# EasyEDA Pro project ProDoc_Board1_Smaller_2026-06-28.epro

# Schematic Schematic1_1
Create Date: 2024-08-01; Page Name: P1; Project Name: LED board Gelsight; Schematic Name: Schematic1_1; Update Date: 2024-08-03
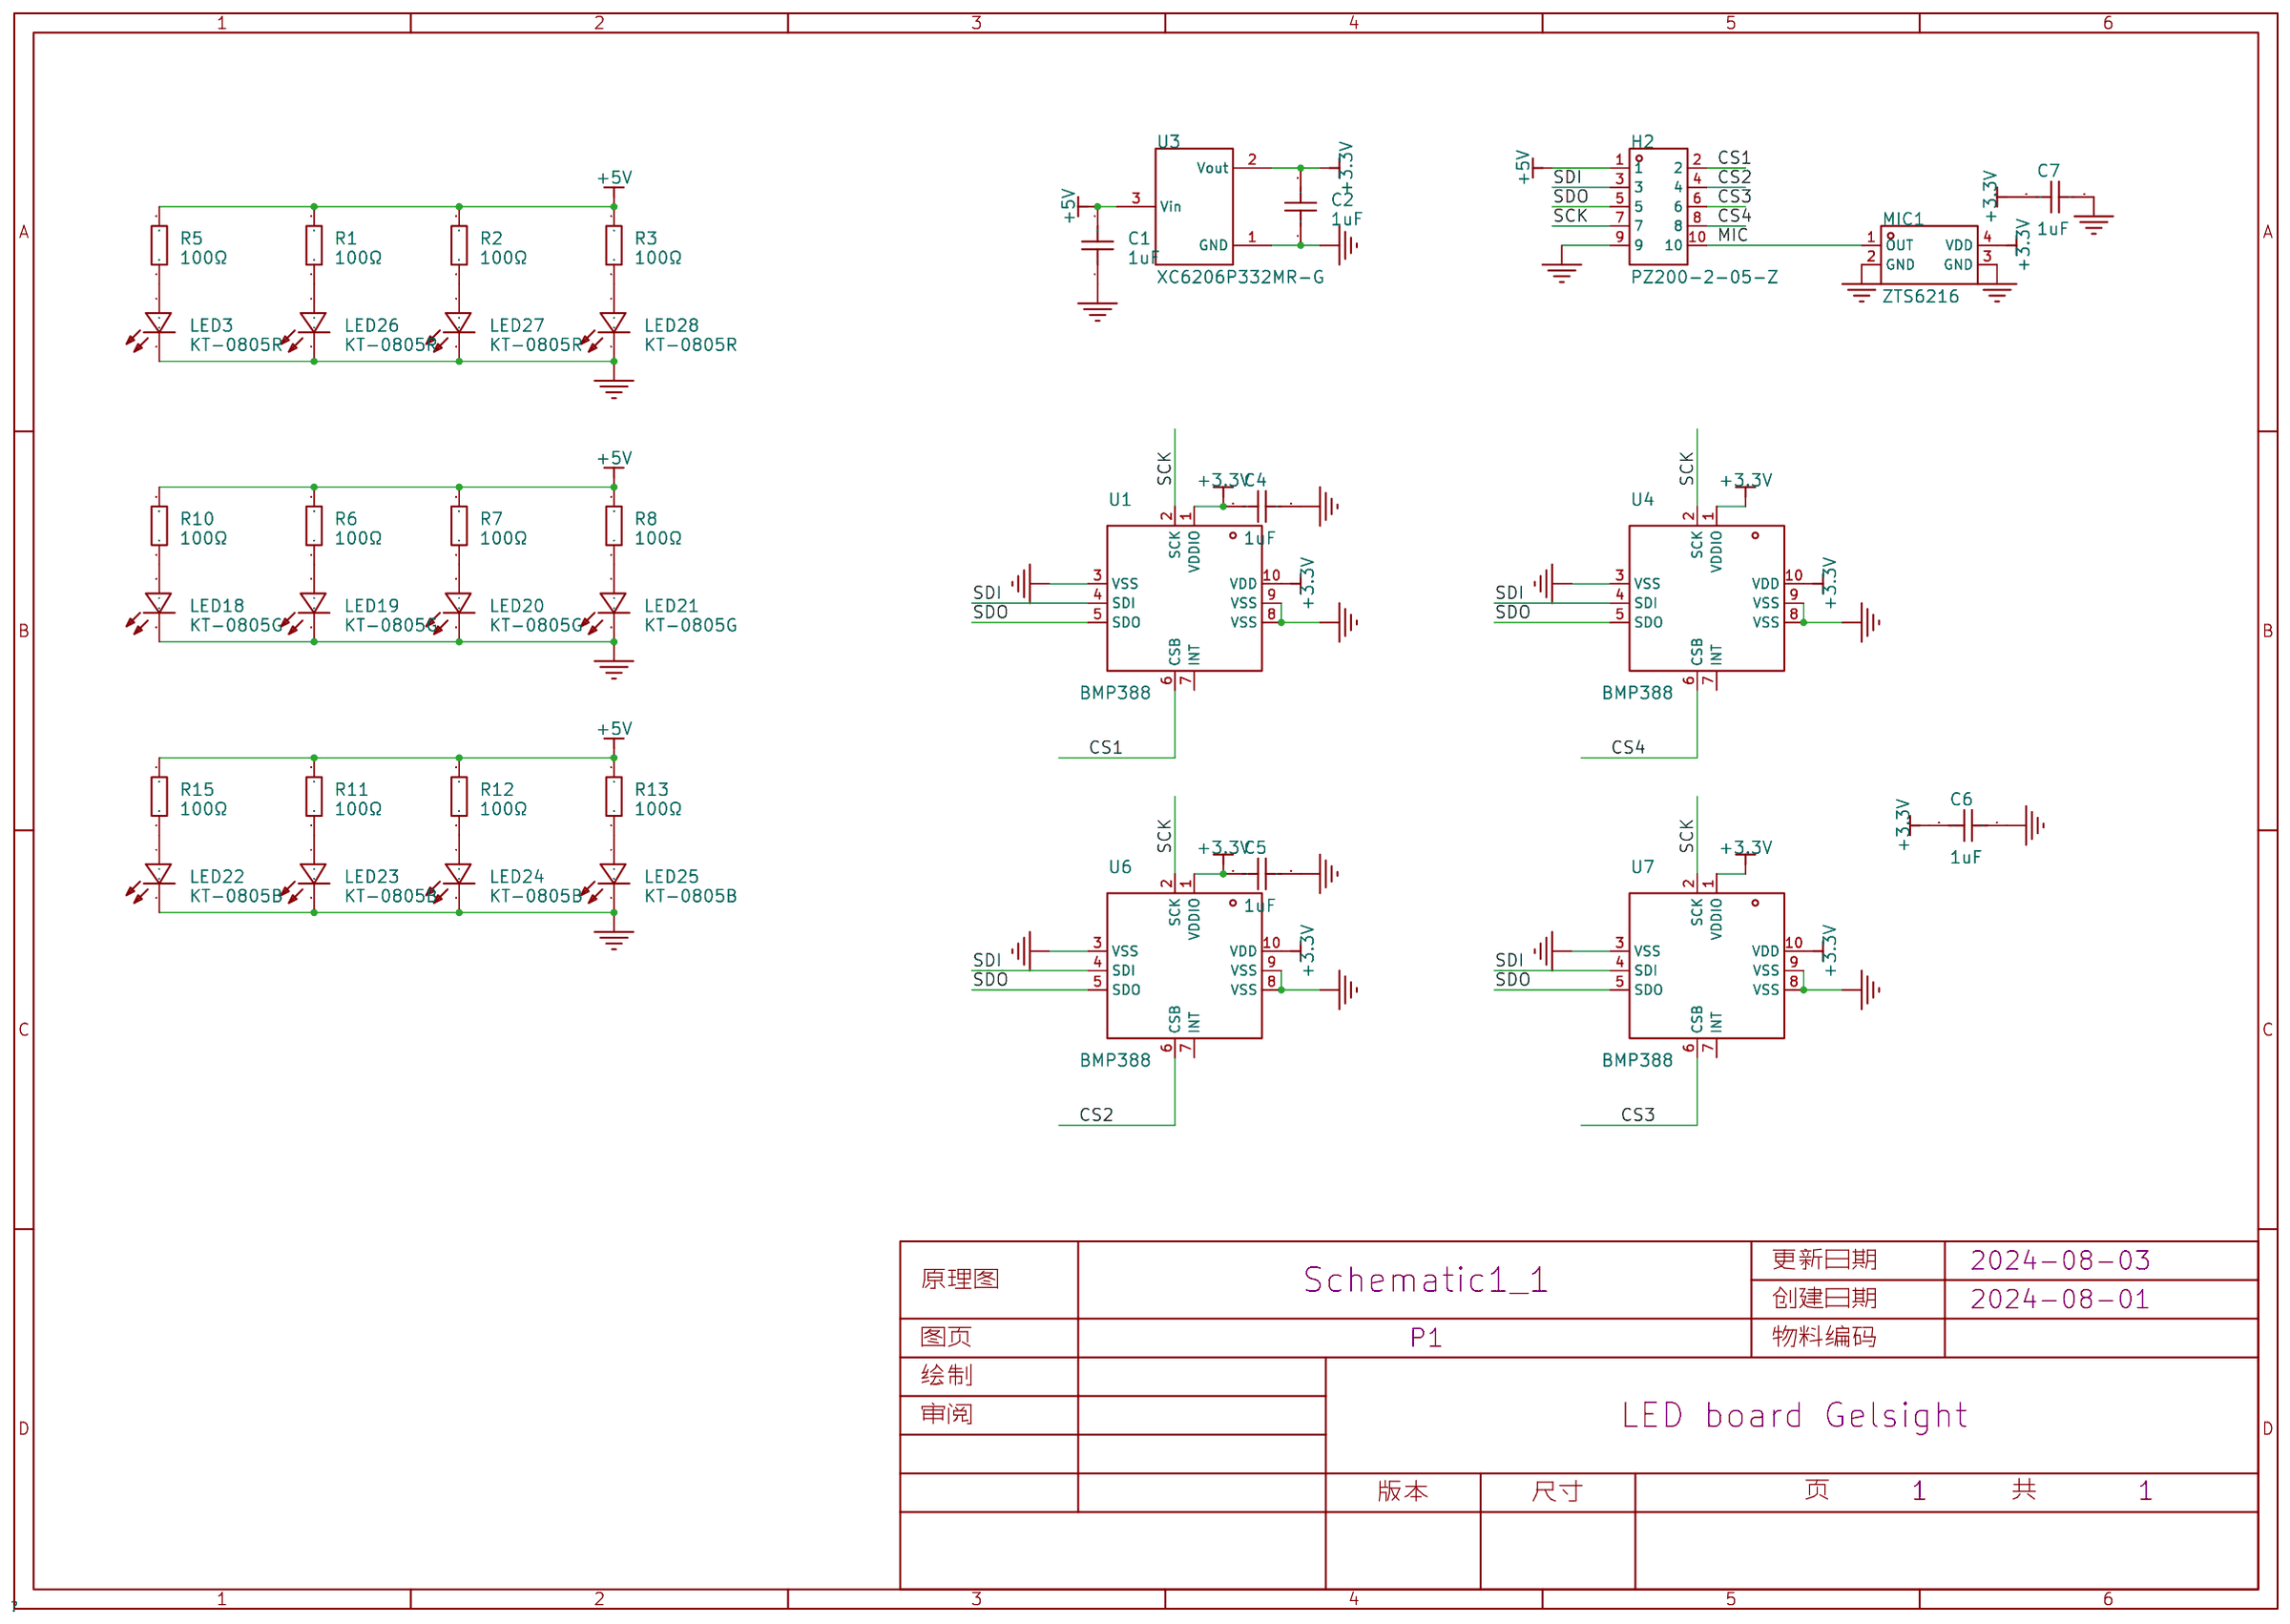
[diagram p0: schematic sheet]

## Parts
C1  1uF  [C0402]
C2  1uF  [C0402]
C4  1uF  [C0402]
C5  1uF  [C0402]
C6  1uF  [C0402]
C7  1uF  [C0402]
H2  PZ200-2-05-Z  [HDR-TH_10P-P2.00-V-M-R2-C5-S2.00]
LED3  KT-0805R  [LED0805-R-RD]
LED18  KT-0805G  [LED0805-R-RD]
LED19  KT-0805G  [LED0805-R-RD]
LED20  KT-0805G  [LED0805-R-RD]
LED21  KT-0805G  [LED0805-R-RD]
LED22  KT-0805B  [LED0805-R-RD]
LED23  KT-0805B  [LED0805-R-RD]
LED24  KT-0805B  [LED0805-R-RD]
LED25  KT-0805B  [LED0805-R-RD]
LED26  KT-0805R  [LED0805-R-RD]
LED27  KT-0805R  [LED0805-R-RD]
LED28  KT-0805R  [LED0805-R-RD]
MIC1  ZTS6216  [MIC-SMD_4P-L2.8-W1.9-P1.84-TL]
R1  100Ω  [R0402]
R2  100Ω  [R0402]
R3  100Ω  [R0402]
R5  100Ω  [R0402]
R6  100Ω  [R0402]
R7  100Ω  [R0402]
R8  100Ω  [R0402]
R10  100Ω  [R0402]
R11  100Ω  [R0402]
R12  100Ω  [R0402]
R13  100Ω  [R0402]
R15  100Ω  [R0402]
U1  BMP388  [SENSORM-SMD_BMP388]
U3  XC6206P332MR-G  [SOT-23-3_L2.9-W1.6-P1.90-LS2.8-BR]
U4  BMP388  [SENSORM-SMD_BMP388]
U6  BMP388  [SENSORM-SMD_BMP388]
U7  BMP388  [SENSORM-SMD_BMP388]

## Library data of the parts
C1 C2 C4-C7 = CL05A105KA5NQNC: 容值:1uF;精度:±10%;额定电压:25V;材质(温度系数):X5R;; LCSC Part Name: 1uF ±10% 25V; Supplier Part: C52923; Manufacturer: SAMSUNG(三星); Supplier Footprint: 0402; JLCPCB Part Class: Basic Part; Datasheet: https://atta.szlcsc.com/upload/public/pdf/source/20160218/1457707763339.pdf; Supplier: LCSC; Tolerance: ±10%; Voltage Rated: 25V; Temperature Coefficient: X5R
H2 = PZ200-2-05-Z: 插针结构:2x5P;间距:2mm;行距:2mm;圆针/方针:方针;安装类型:直插;排数:双排;总PIN位数:10P;额定电流:1.5A;额定电压:-;配合针长度:4mm;塑高:2mm;端接针长度:2.8mm;触头材质:黄铜;工作温度范围:-40℃~+105℃;焊接温度(最大值):260℃@5S;颜色:黑色;; LCSC Part Name: 2x5P 间距:2mm 方针 直插; Supplier Part: C2905991; Manufacturer: HCTL(华灿天禄); Supplier Footprint: 插件,P=2mm; JLCPCB Part Class: Extended Part; Datasheet: https://atta.szlcsc.com/upload/public/pdf/source/20230609/E9B292E9F4F82C2859D5665FE1B563FB.pdf; Supplier: LCSC; Pin Structure: 2x5P; Pitch: 2mm; Row Spacing: 2mm; Circluar Pins/Square Pins: 方针; Mounting Type: 直插; Number of Rows: 双排; Number of Pins: 10P; Current Rating (Max): 1.5A; Length of Mating Pin: 4mm; Insulation Height: 2mm; Length of End Connection Pin: 2.8mm; Contact Material: 黄铜; Operating Temperature Range: -40℃~+105℃; Soldering Temperature(Max): 260℃@5S; Color: 黑色
LED3 LED26-LED28 = KT-0805R: 亮度值 Iv=90~100mcd @IF=20mA; LCSC Part Name: 0805 红灯 高亮; Supplier Part: C2295; Manufacturer: KENTO; Supplier Footprint: 0805; JLCPCB Part Class: Extended Part; Supplier: LCSC
LED18-LED21 = KT-0805G: 灯头类型:-;发光颜色:翠绿色;正向电压(VF):-;功率:-;正向电流:-;主波长:-;二极管配置:-;透镜颜色:-;色温:-;发光强度:-;发光角度:-;载带方式:-;工作温度:-;; LCSC Part Name: 0805 翠绿 高亮; Supplier Part: C2297; Manufacturer: KENTO; Supplier Footprint: 0805; JLCPCB Part Class: Basic Part; Datasheet: https://atta.szlcsc.com/upload/public/pdf/source/20170209/1486607340485.pdf; Supplier: LCSC; Emitted Color: 翠绿色
LED22-LED25 = KT-0805B: LCSC Part Name: 0805 蓝灯 高亮; Supplier Part: C2293; Manufacturer: KENTO; Supplier Footprint: 0805; JLCPCB Part Class: Extended Part; Datasheet: https://atta.szlcsc.com/upload/public/pdf/source/20150723/1457707334170.pdf; Supplier: LCSC
MIC1 = ZTS6216: 方向:全指向;信噪比:65dB;灵敏度:-38dB;阻抗:100Ω;; Supplier Part: C481302; Manufacturer: ZILLTEK(钰太); Supplier Footprint: SMD-4P,1.9x2.8mm; JLCPCB Part Class: Extended Part; Datasheet: https://atta.szlcsc.com/upload/public/pdf/source/20200316/C481302_3CBECE2A7DED4DFD53CEA082844189F4.pdf; Supplier: LCSC; Direction: 全指向; Supply Voltage: 1.5V~3.6V; Current Consumption: 120uA; SNR(Signal to Noise Ratio): 65dB; Sensitivity: -38dB; Impedance: 100Ω
R1-R3 R5-R8 R10-R13 R15 = 0402WGF1000TCE: 电阻类型:厚膜电阻;阻值:100Ω;精度:±1%;功率:62.5mW;最大工作电压:50V;温度系数:±200ppm/℃;; LCSC Part Name: 100Ω ±1% 62.5mW 厚膜电阻; Supplier Part: C25076; Manufacturer: UNI-ROYAL(厚声); Supplier Footprint: 0402; JLCPCB Part Class: Basic Part; Datasheet: https://atta.szlcsc.com/upload/public/pdf/source/20200306/C422600_1E6D84923E4A46A82E41ADD87F860B5C.pdf; Supplier: LCSC; Type: 厚膜电阻; Tolerance: ±1%; Power(Watts): 62.5mW; Overload Voltage (Max): 50V; Temperature Coefficient: ±200ppm/℃; Operating Temperature Range: -55℃~+155℃
U1 U4 U6 U7 = BMP388: 压力范围:30Kpa~125Kpa;; Supplier Part: C779278; Manufacturer: Bosch(博世); Supplier Footprint: LGA-10(2x2); JLCPCB Part Class: Extended Part; Datasheet: https://atta.szlcsc.com/upload/public/pdf/source/20211019/91C230A1D32F1E776DA878FFB43C8B15.pdf; Supplier: LCSC; Pressure range: 30Kpa~125Kpa; The Power Supply Voltage: 1.65V~3.6V
U3 = XC6206P332MR-G_C5446: 输出类型:固定;最大输入电压:6V;输出电压:3.3V;最大输出电流:200mA;电源纹波抑制比(PSRR):-;输出极性:正极;; LCSC Part Name: 输入6V 输出3.3V 200mA; Supplier Part: C5446; Manufacturer: TOREX(特瑞仕); Supplier Footprint: SOT-23-3L; JLCPCB Part Class: Basic Part; Datasheet: https://atta.szlcsc.com/upload/public/pdf/source/20130823/1457706639850.pdf; Supplier: LCSC; Output Type: 固定; Maximum Input Voltage: 6V; Output Voltage: 3.3V; MAX Output Current: 200mA; Dropout Voltage: 680mV@(100mA); Output Polarity: 正极; Number of Outputs: 1

## Nets
+3.3V: C2.2 C4.2 C5.2 C6.2 C7.1 MIC1.4(VDD) U1.1(VDDIO) U1.10(VDD) U3.2(Vout) U4.1(VDDIO) U4.10(VDD) U6.1(VDDIO) U6.10(VDD) U7.1(VDDIO) U7.10(VDD)
+5V: C1.2 H2.1 R1.2 R2.2 R3.2 R5.2 R6.2 R7.2 R8.2 R10.2 R11.2 R12.2 R13.2 R15.2 U3.3(Vin)
GND: C1.1 C2.1 C4.1 C5.1 C6.1 C7.2 H2.9 LED3.2(K) LED18.2(K) LED19.2(K) LED20.2(K) LED21.2(K) LED22.2(K) LED23.2(K) LED24.2(K) LED25.2(K) LED26.2(K) LED27.2(K) LED28.2(K) MIC1.2(GND) MIC1.3(GND) U1.3(VSS) U1.8(VSS) U1.9(VSS) U3.1(GND) U4.3(VSS) U4.8(VSS) U4.9(VSS) U6.3(VSS) U6.8(VSS) U6.9(VSS) U7.3(VSS) U7.8(VSS) U7.9(VSS)
CS1: H2.2 U1.6(CSB)
CS2: H2.4 U6.6(CSB)
CS3: H2.6 U7.6(CSB)
CS4: H2.8 U4.6(CSB)
MIC: H2.10 MIC1.1(OUT)
SCK: H2.7 U1.2(SCK) U4.2(SCK) U6.2(SCK) U7.2(SCK)
SDI: H2.3 U1.4(SDI) U4.4(SDI) U6.4(SDI) U7.4(SDI)
SDO: H2.5 U1.5(SDO) U4.5(SDO) U6.5(SDO) U7.5(SDO)
$1N1692: LED18.1(A) R10.1
$1N1740: LED19.1(A) R6.1
$1N1788: LED20.1(A) R7.1
$1N1834: LED21.1(A) R8.1
$1N1906: LED22.1(A) R15.1
$1N1940: LED23.1(A) R11.1
$1N2004: LED25.1(A) R13.1
$1N2041: LED24.1(A) R12.1
$1N12576: LED3.1(A) R5.1
$1N12608: LED26.1(A) R1.1
$1N12641: LED27.1(A) R2.1
$1N12674: LED28.1(A) R3.1

Not connected (* = marked no-connect by the designer): U1 7(INT); U4 7(INT); U6 7(INT); U7 7(INT)

# Board PCB1_1
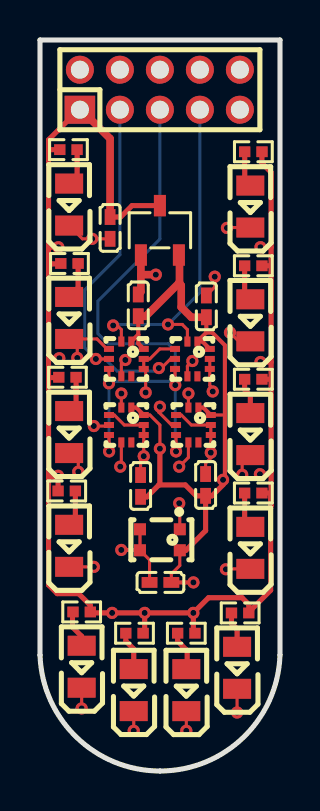
[diagram p1: board, top side]
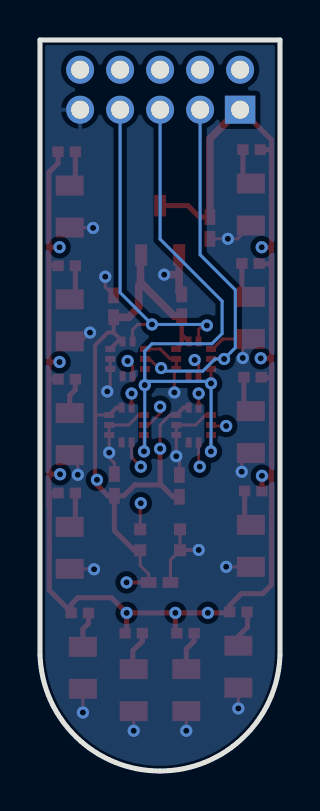
[diagram p2: board, bottom side, seen from below]

Outline 12 x 36.56 mm; copper layers: Top Layer, Inner1, Inner2, Bottom Layer. Coordinates in mm from the lower left corner of the outline.
Outline path: 0,36.56 12,36.56 12,5.8 arc(10.19,1.7) 6,0 arc(1.82,1.7) 0,5.8 0,36.56
Stack: Top Layer 0.035mm 外层铜厚1oz / Dielectric1 0.2104mm 7628 RC49% 8.6mil / Inner1 0.0152mm 内层铜厚 / Dielectric2 1.065mm 1.1mm H/HOZ 含铜 / Inner2 0.0152mm 内层铜厚 / Dielectric3 0.2104mm 7628 RC49% 8.6mil / Bottom Layer 0.035mm 外层铜厚1oz

## Design rules (mm)
spacing copperThickness1oz (default): track to track 0.102, other pairs 0.152 to 0.3
spacing copperThickness2oz: track to track 0.203, other pairs 0.152 to 0.3
spacing Plane_innerPlane: track to track 0.102, other pairs 0.152 to 0.3
spacing Copper_copperRegion: track to track 0.102, other pairs 0.152 to 0.3
track width copperThickness1oz (default): min 0.127, default 0.254, max 2.54
track width copperThickness2oz: min 0.203, default 0.254, max 2.54
differential pair differentialPair (default): width min 0.127, default 0.254, max 2.54; gap min 0.152, default 0.152
region e1 uses Copper_copperRegion
region e2 uses Copper_copperRegion
region e3 uses Copper_copperRegion
pour e351 uses Copper_copperRegion
pour e356 uses Copper_copperRegion

## Placement (name value [footprint] x y rotation side)
C1  1uF  [C0402]  3.5 27.16 90 top
C2  1uF  [C0402]  5.03 14.25 270 top
C4  1uF  [C0402]  4.91 23.29 270 top
C5  1uF  [C0402]  8.28 14.31 270 top
C6  1uF  [C0402]  8.32 23.23 270 top
C7  1uF  [C0402]  6.02 9.43 180 top
H2  PZ200-2-05-Z  [HDR-TH_10P-P2.00-V-M-R2-C5-S2.00]  5.99 34.07 0 top
LED3  KT-0805R  [LED0805-R-RD]  1.46 11.26 90 top
LED18  KT-0805G  [LED0805-R-RD]  2.08 5.21 90 top
LED19  KT-0805G  [LED0805-R-RD]  4.69 4.05 90 top
LED20  KT-0805G  [LED0805-R-RD]  7.31 4.04 90 top
LED21  KT-0805G  [LED0805-R-RD]  9.85 5.16 90 top
LED22  KT-0805B  [LED0805-R-RD]  10.52 11.16 90 top
LED23  KT-0805B  [LED0805-R-RD]  10.52 16.85 90 top
LED24  KT-0805B  [LED0805-R-RD]  10.52 22.54 90 top
LED25  KT-0805B  [LED0805-R-RD]  10.52 28.23 90 top
LED26  KT-0805R  [LED0805-R-RD]  1.46 22.66 90 top
LED27  KT-0805R  [LED0805-R-RD]  1.46 16.95 90 top
LED28  KT-0805R  [LED0805-R-RD]  1.46 28.33 90 top
MIC1  ZTS6216  [MIC-SMD_4P-L2.8-W1.9-P1.84-TL]  5.99 11.56 270 top
R1  100Ω  [R0402]  1.47 25.38 180 top
R2  100Ω  [R0402]  1.37 19.69 180 top
R3  100Ω  [R0402]  1.42 31.07 180 top
R5  100Ω  [R0402]  1.34 14 180 top
R6  100Ω  [R0402]  4.72 6.89 0 top
R7  100Ω  [R0402]  7.31 6.89 0 top
R8  100Ω  [R0402]  10.01 7.9 0 top
R10  100Ω  [R0402]  2.08 7.95 0 top
R11  100Ω  [R0402]  10.66 19.59 0 top
R12  100Ω  [R0402]  10.66 25.27 0 top
R13  100Ω  [R0402]  10.67 30.97 0 top
R15  100Ω  [R0402]  10.66 13.9 0 top
U1  BMP388  [SENSORM-SMD_BMP388]  4.32 20.61 0 top
U3  XC6206P332MR-G  [SOT-23-3_L2.9-W1.6-P1.90-LS2.8-BR]  5.99 27.04 270 top
U4  BMP388  [SENSORM-SMD_BMP388]  7.62 20.61 0 top
U6  BMP388  [SENSORM-SMD_BMP388]  4.32 17.3 0 top
U7  BMP388  [SENSORM-SMD_BMP388]  7.67 17.3 0 top

## Footprints (pads in the part's own frame, mm; a bottom-side part is the same pattern mirrored in y, then rotated)
C0402
  rect 0.79x0.54 smd: 1(-0.545,0) 2(0.545,0)
HDR-TH_10P-P2.00-V-M-R2-C5-S2.00
  rect 1.524x1.4 hole 0.9: 1(-4,-1)
  round 1.4 hole 0.9: 2(-4,1) 3(-2,-1) 4(-2,1) 5(0,-1) 6(0,1) 7(2,-1) 8(2,1) 9(4,-1) 10(4,1)
LED0805-R-RD
  rect 1x1.399 smd: 1(1.05,0) 2(-1.05,0)
MIC-SMD_4P-L2.8-W1.9-P1.84-TL
  rect 0.6x0.6 smd: 1(-0.525,0.995) 2(-0.525,-0.995) 3(0.525,-0.995) 4(0.525,0.995)
R0402
  rect 0.566x0.54 smd: 1(-0.433,0) 2(0.433,0)
SENSORM-SMD_BMP388
  rect 0.3x0.5 smd: 1(0.25,0.871) 2(-0.25,0.871) 6(-0.25,-0.871) 7(0.25,-0.871)
  rect 0.5x0.3 smd: 3(-0.869,0.5) 4(-0.869,0) 5(-0.869,-0.5) 8(0.869,-0.5) 9(0.869,0) 10(0.869,0.5)
SOT-23-3_L2.9-W1.6-P1.90-LS2.8-BR
  rect 1.07x0.6 smd: 1(1.235,-0.95) 2(1.235,0.95) 3(-1.235,0)

## Nets
As in the schematic.

Pads without a net: U1 7; U4 7; U6 7; U7 7

## Via types
v1: diameter 0.61, hole 0.305, Top Layer to Bottom Layer, 48 vias

## Routing (per net, layer and track width the routed paths; a pad name or vN(x,y) marks a point on that pad's centre or on a via; arc(x,y) is an arc through that point)
+3.3V: length 40
  Top Layer w0.152: 8.54,17.8 9.22,17.8 9.22,14.63 ; v1(5.99,16.12) 5.99,17.3 5.49,17.8 5.19,17.8 ; C7.1 6.57,9.85 6.99,10.28 MIC1.4
  Top Layer w0.203: 8.32,21.93 7.87,21.48 8.12,21.48 U4.10 ; 8.32,21.93 8.61,21.93 9.25,21.29 9.25,14.66 9.22,14.63 ; 8.32,21.93 C6.2 ; 8.54,17.8 8.17,18.17 U7.1 ; C7.1 v1(7.67,9.43) ; 4.91,21.82 4.91,21.38 U1.10 ; 4.91,21.82 4.91,22.74 ; 4.91,21.82 4.57,21.48 ; U6.1 4.82,18.17 5.19,17.8
  Top Layer w0.254: v1(9.15,14.56) 9.15,14.31 8.6,13.76 C5.2 ; 5.94,14.31 5.35,13.71 C2.2 ; 5.94,14.31 7.26,14.31 7.81,13.76 C5.2 ; 5.94,14.31 5.99,14.36 v1(5.99,16.12) ; MIC1.4 7.3,11.04 8.28,12.02 C5.2
  Top Layer w0.381: 6.94,24.4 6.97,24.43 6.97,25.77 U3.2 ; 6.94,24.4 7.06,24.28 7.06,23.2 7.57,22.69 C6.2 ; 6.94,24.4 5.29,22.74 4.91,22.74
+5V: length 78.1
  Top Layer w0.254: 11.56,20.45 11.56,25.31 ; 11.56,20.45 11.56,19.59 ; 11.56,20.45 v1(11.02,20.45) ; 11.56,25.31 11.52,25.27 R12.2 ; 11.56,25.31 11.56,26.19 ; 0.43,25.36 0.43,26.23 ; 0.43,25.36 0.43,20.64 ; 0.43,25.36 0.88,25.36 0.9,25.38 ; 0.43,26.23 0.43,31.08 ; 0.43,26.23 0.46,26.19 v1(0.91,26.19) ; 0.43,20.64 v1(0.96,20.64) ; 0.43,20.64 0.43,19.67 ; R3.2 0.44,31.07 0.43,31.08 ; 11.1,30.92 11.1,30.4 11.56,29.94 11.56,26.19 ; 11.56,14.97 11.56,13.26 11.53,13.24 ; 11.56,14.97 11.56,19.59 ; 11.56,14.97 11.43,14.84 v1(11,14.84) ; 11.56,19.59 R11.2 ; 5.16,6.89 5.23,6.97 v1(5.23,7.91) ; 11.53,13.24 11.53,13.9 R15.2 ; 11.53,13.24 11.53,9.04 10.45,7.96 10.44,7.96 10.44,8.33 10.1,8.67 8.43,8.67 v1(7.67,7.91) ; 0.43,14.71 0.85,14.71 v1(0.9,14.76) R5.2 ; 0.43,14.71 0.43,9.31 0.86,8.87 1.93,8.87 2.52,8.28 R10.2 ; 0.43,14.71 0.43,19.67 ; 0.43,31.08 0.43,31.56 1.93,33.07 H2.1 ; U3.3 4.6,28.27 4.03,27.7 C1.2 ; v1(5.23,7.91) v1(7.67,7.91) ; v1(5.23,7.91) v1(3.61,7.91) 2.52,7.91 ; v1(7.67,7.91) 7.67,6.97 R7.2 ; 0.9,19.69 0.88,19.67 0.43,19.67 ; 11.56,26.19 v1(11.02,26.19)
  Top Layer w0.381: C1.2 3.5,31.62 2.06,33.07 H2.1
GND: length 38.8
  Top Layer w0.152: 5.48,9.43 5.48,10.56 MIC1.3 MIC1.2 ; U1.3 3.35,21.11 2.85,21.61 LED26.2 1.86,21.2 v1(1.86,20.66) ; C6.1 8.74,24.2 v1(8.74,24.72) ; v1(9.3,10.09) 9.32,10.11 LED22.2 ; v1(9.35,27.16) 9.37,27.18 10.52,27.18 ; v1(1.91,14.97) 1.91,15.44 LED27.2 ; U4.3 5.99,21.11 5.49,20.61 U1.9 U1.8 5.28,20.01 v1(5.28,18.93) ; C1.1 v1(2.61,26.61) 2.12,26.61 1.46,27.28 ; LED20.2 v1(7.31,2.01) ; v1(9.5,21.93) 9.94,21.49 LED24.2 ; C5.1 8.28,15.4 8.54,15.66 U7.9 7.57,17.3 7.07,17.8 6.8,17.8 ; LED18.2 v1(2.08,3.13) ; LED21.2 v1(9.85,2.93) ; 3.45,17.8 3.72,17.8 4.22,17.3 U6.9 v1(5.19,15.74) 5.03,15.59 C2.1 ; v1(8.64,18.98) 8.64,19.13 8.49,19.28 U4.8 U4.9 ; LED3.2 v1(2.69,10.21) ; v1(10.11,14.81) 10.11,15.39 LED23.2 ; LED19.2 v1(4.69,2.01)
  Top Layer w0.203: v1(4.06,11.05) 4.98,11.05 MIC1.3
  Top Layer w0.381: 5.04,24.77 5.09,24.82 v1(5.79,24.82) ; 5.04,24.77 5.04,23.96 C4.1 ; 5.04,24.77 U3.1
  vias: v1(8.54,15.92)
CS1: length 16.4
  Top Layer w0.152: v1(4.27,20.55) 4.07,20.35 U1.6
  Inner1 w0.152: v1(4.27,20.55) 4.27,31.07 3.05,32.29 3.05,34.02 H2.2
CS2: length 21.8
  Top Layer w0.152: v1(4.01,15.22) 4.07,15.27 U6.6
  Inner1 w0.152: v1(4.01,15.22) 4.01,18.07 4.6,18.66 4.6,20.04 4.92,20.36 4.92,34.14 H2.4
CS3: length 22.5
  Top Layer w0.152: U7.6 7.42,15.68 v1(6.96,15.22)
  Inner1 w0.152: H2.6 6.96,34.1 6.96,20.25 7.98,19.23 7.98,16.24 v1(6.96,15.22)
CS4: length 16.4
  Top Layer w0.152: U4.6 7.37,20.25 v1(7.62,20.5)
  Inner1 w0.152: H2.8 8.99,34.07 8.99,32.54 7.62,31.17 v1(7.62,20.5)
MIC: length 25
  Top Layer w0.152: v1(6.96,13.39) 6.99,13.36 MIC1.1
  Inner1 w0.152: H2.10 10.93,34.14 10.93,32.17 10.31,31.55 10.31,16.74 v1(6.96,13.39)
SCK: length 27
  Top Layer w0.152: 7.37,21.48 7.37,22.07 7.11,22.33 v1(6.4,22.33) ; 4.07,21.48 4.07,22.07 3.86,22.28 v1(3.66,22.28) ; U6.2 v1(4.07,18.88) ; U7.2 v1(7.42,18.88)
  Inner1 w0.152: v1(4.07,18.88) 4.07,19.74 3.56,20.25 3.56,22.18 v1(3.66,22.28) ; v1(7.42,18.88) 7.22,18.67 6.45,18.67 6.23,18.9 6.23,19.66 6.6,20.04 6.6,22.13 v1(6.4,22.33)
  Bottom Layer w0.152: v1(3.66,22.28) 3.71,22.33 v1(6.4,22.33) 7.99,23.93 H2.7
SDI: length 26.1
  Top Layer w0.152: v1(2.69,17.25) 3.4,17.25 U6.4 ; U4.4 6.53,20.61 6.07,20.15 v1(5.94,20.15) ; v1(2.79,20.6) 3.45,20.6 U1.4 ; U7.4 6.58,17.3 5.94,17.94 5.94,18.17 v1(5.99,18.22)
  Inner1 w0.152: v1(5.94,20.15) 5.94,18.27 v1(5.99,18.22) ; v1(2.79,20.6) 2.79,17.35 v1(2.69,17.25)
  Bottom Layer w0.152: H2.3 3.99,25.82 2.23,24.06 2.23,21.16 v1(2.79,20.6) 3.25,20.6 3.86,20 5.79,20 v1(5.94,20.15)
SDO: length 32.2
  Top Layer w0.152: 6.8,16.8 6.8,15.78 ; v1(6.76,19.3) 6.75,19.31 U4.5 ; 3.45,16.81 3.45,15.78 3.45,15.78 ; U1.5 v1(3.45,19.39)
  Bottom Layer w0.152: v1(6.76,19.3) 6.76,16.02 v1(6.8,15.98) ; v1(6.76,19.3) 6.57,19.49 3.55,19.49 v1(3.45,19.39) 3.45,15.99 v1(3.45,15.98) ; v1(6.76,19.3) 6.76,21 6.4,21.37 3.4,21.37 2.9,21.87 2.9,23.5 5.99,26.6 H2.5
$1N1692: length 1.9
  Top Layer w0.254: LED18.1 2.08,6.74 1.63,7.19 1.63,7.93 R10.1
$1N1740: length 2
  Top Layer w0.254: 4.69,5.1 4.69,6.1 4.29,6.49 R6.1
$1N1788: length 2
  Top Layer w0.254: R7.1 6.88,6.49 7.36,6.02 7.36,5.1
$1N1834: length 1.8
  Top Layer w0.254: LED21.1 9.85,7.1 9.57,7.38 9.57,7.9
$1N1906: length 1.8
  Top Layer w0.254: R15.1 10.23,12.49 10.52,12.21
$1N1940: length 1.8
  Top Layer w0.254: 10.52,17.9 10.52,18.78 10.23,19.07 R11.1
$1N2004: length 1.8
  Top Layer w0.254: LED25.1 10.23,29.56 R13.1
$1N2041: length 1.8
  Top Layer w0.254: LED24.1 10.23,23.87 R12.1
$1N12576: length 1.8
  Top Layer w0.254: 1.46,12.31 1.77,12.62 R5.1
$1N12608: length 1.9
  Top Layer w0.254: R1.1 1.91,24.16 LED26.1
$1N12641: length 1.8
  Top Layer w0.254: R2.1 1.8,18.35 LED27.1
$1N12674: length 1.9
  Top Layer w0.254: R3.1 1.85,29.78 LED28.1

## Copper pours and planes (outline as drawn; the poured copper is in the pictures)
+5V on Inner1: -1.02,37.37 12.29,37.37 12.29,0.34 -1.02,0.34
GND on Bottom Layer: -1.17,37.72 12.9,37.72 12.9,-0.63 -1.17,-0.63
GND on Inner2: 0.26,36.3 11.74,36.3 11.74,0.26 0.26,0.26

Small or netless copper shapes (teardrops, artwork), in the pictures only: 2 on Inner2
